# Altium project UPCNSL-ABS-FLS-RFS.PrjPcb
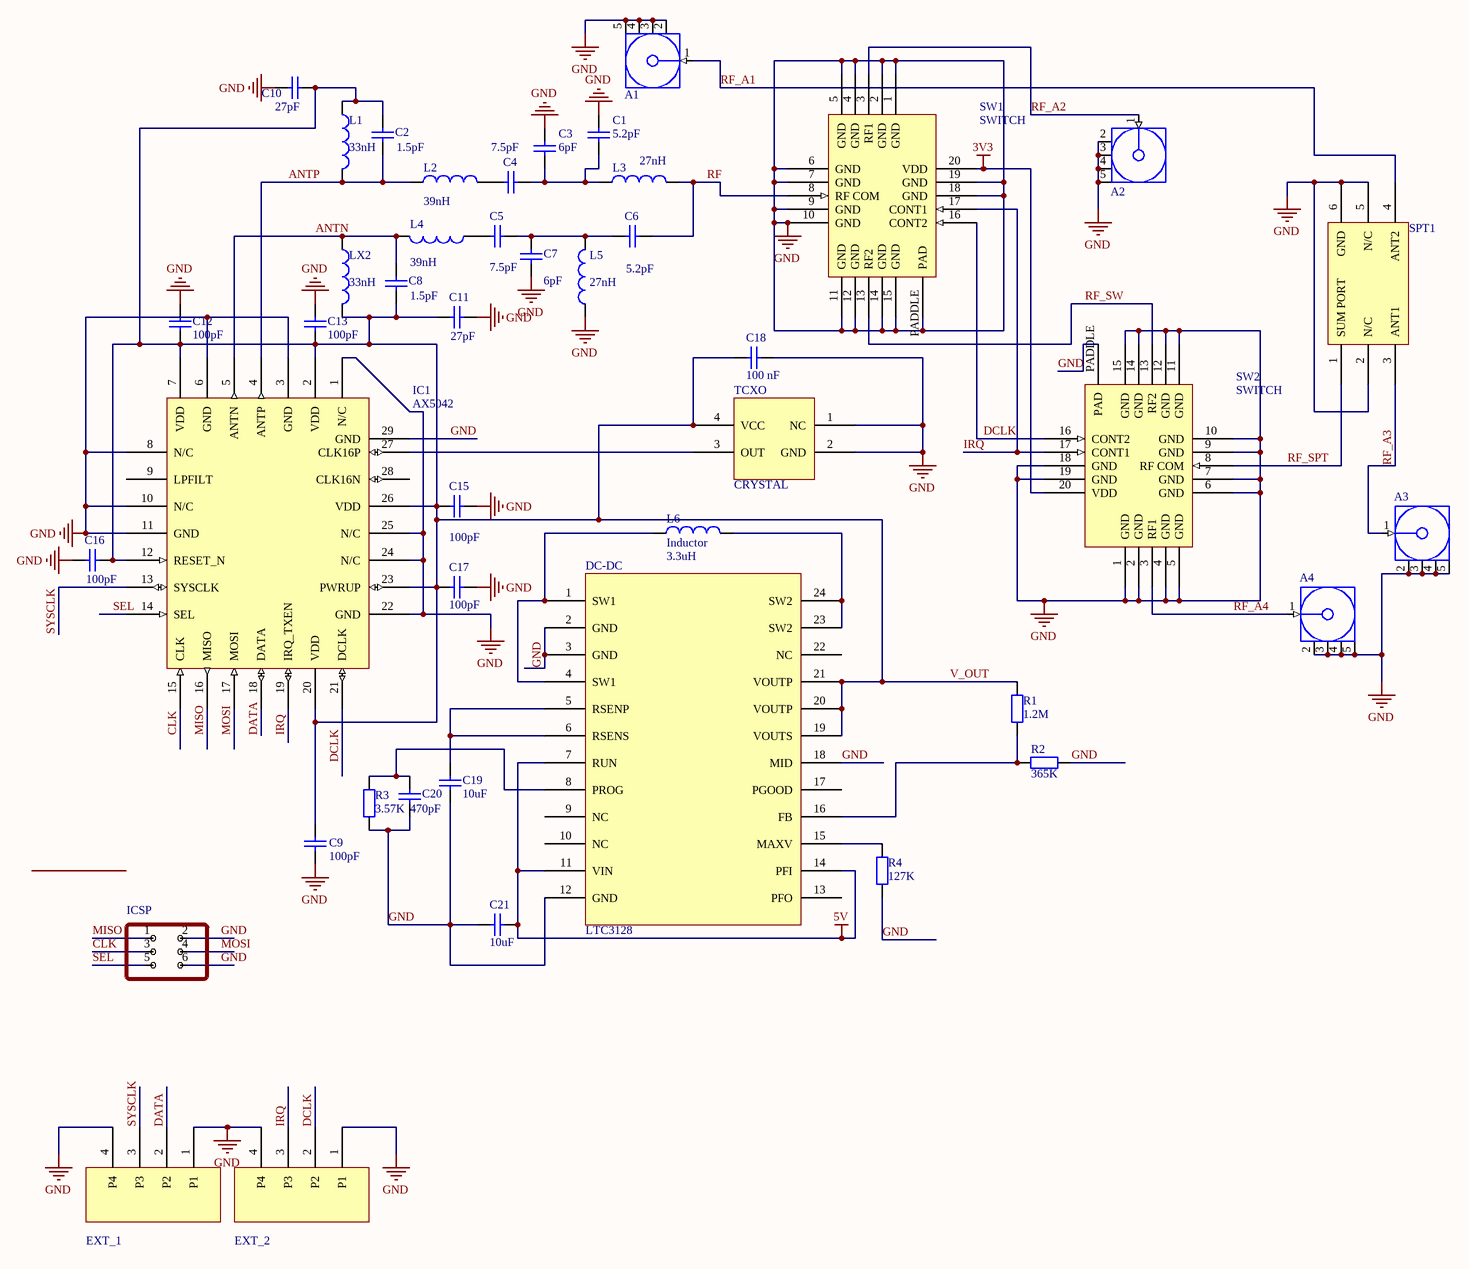
[diagram p0: UPCNSL-ABS-FLS-RFS.SchDoc]
1 sheet, 44 parts. Net scope: global (net labels, ports and power ports of the same name join across sheets).
Board file: UPCNSL-ABS-FLS-RFS.PcbDoc

## Sheet UPCNSL-ABS-FLS-RFS.SchDoc
size A3

### Parts
A1  ANTENNA  [MCX5.08-H5]  (value not drawn)
A2  SORTIDA AMP EXTERN  [MCX5.08-H5]  (value not drawn)
A3  ANTENNA  [MCX5.08-H5]  (value not drawn)
A4  ENTRADA AMP EXTERN  [MCX5.08-H5]  (value not drawn)
C1  value 5.2pF  [CAP0603]  (hidden comment: CB1)
C2  value 1.5pF  [CAP0603]  (hidden comment: CC1)
C3  value 6pF  [CAP0603]  (hidden comment: CM1)
C4  value 7.5pF  [CAP0603]  (hidden comment: CT1)
C5  value 7.5pF  [CAP0603]  (hidden comment: CT2)
C6  value 5.2pF  [CAP0603]  (hidden comment: CB2)
C7  value 6pF  [CAP0603]  (hidden comment: CM2)
C8  value 1.5pF  [CAP0603]  (hidden comment: CC2)
C9  value 100pF  [CAP0603]  (hidden comment: CV1)
C10  value 27pF  [CAP0603]  (hidden comment: Cap)
C11  value 27pF  [CAP0603]  (hidden comment: Cap)
C12  value 100pF  [CAP0603]  (hidden comment: Cap)
C13  value 100pF  [CAP0603]  (hidden comment: Cap)
C15  value 100pF  [CAP0603]  (hidden comment: Cap)
C16  value 100pF  [CAP0603]  (hidden comment: Cap)
C17  value 100pF  [CAP0603]  (hidden comment: Cap)
C18  value 100 nF  [CAP0603]  (hidden comment: Cap)
C19  value 10uF  [CAP0603]  (hidden comment: CAP0603)
C20  value 470pF  [CAP0603]  (hidden comment: CAP0603)
C21  value 10uF  [CAP0603]  (hidden comment: CAP0603)
DC-DC  LTC3128  [DW024 (LTC3128)]
EXT_1  HEADER_CONNECTION  [HEADER_CONNECTION]  (value not drawn)
EXT_2  HEADER_CONNECTION  [HEADER_CONNECTION]  (value not drawn)
IC1  AX5042  [AX5042]
ICSP  3X2M  [Header 3x2]  (value not drawn)
L1  value 33nH  [INDUCTOR(1608)]  (hidden comment: LX1)
L2  value 39nH  [INDUCTOR(1608)]  (hidden comment: LT1)
L3  value 27nH  [INDUCTOR(1608)]  (hidden comment: LB2)
L4  value 39nH  [INDUCTOR(1608)]  (hidden comment: LT2)
L5  value 27nH  [INDUCTOR(1608)]  (hidden comment: LB1)
L6  Inductor  value 3.3uH  [INDUCTOR(1608)]
LX2  value 33nH  [INDUCTOR(1608)]  (hidden comment: LX2)
R1  value 1.2M  [RES0603]  (hidden comment: RES0603)
R2  value 365K  [RES0603]  (hidden comment: RES0603)
R3  value 3.57K  [RES0603]  (hidden comment: RES0603)
R4  value 127K  [RES0603]  (hidden comment: RES0603)
SPT1  2 Way -0º split  [SOTFL254P691X411-6N(splitter 2 way-0)]  (value not drawn)
SW1  SWITCH  [SWITCH]
SW2  SWITCH  [SWITCH]
TCXO  CRYSTAL  [CRYSTAL TG-5006CJ-24L]

### Nets
3V3: SW1.20(VDD) SW2.20(VDD)
5V: C21.1 DC-DC.7(RUN) DC-DC.11(VIN) DC-DC.14(PFI)
GND: A1.2(GND) A1.3(GND) A1.4(GND) A1.5(GND) A2.2(GND) A2.3(GND) A2.4(GND) A2.5(GND) A3.2(GND) A3.3(GND) A3.4(GND) A3.5(GND) A4.2(GND) A4.3(GND) A4.4(GND) A4.5(GND) C1.2 C3.2 C7.2 C9.1 C10.1 C11.2 C12.2 C13.2 C15.2 C16.1 C17.1 C18.1 C19.1 C20.1 C21.2 DC-DC.2(GND) DC-DC.3(GND) DC-DC.12(GND) DC-DC.18(MID) EXT_1.1(P1) EXT_1.4(P4) EXT_2.1(P1) EXT_2.4(P4) IC1.1(N/C) IC1.3(GND) IC1.6(GND) IC1.8(N/C) IC1.10(N/C) IC1.11(GND) IC1.22(GND) IC1.24(N/C) IC1.25(N/C) IC1.29(GND) ICSP.2 ICSP.6 L5.1 R2.1 R3.1 R4.1 SPT1.2(N/C) SPT1.5(N/C) SPT1.6(GND) SW1.1(GND) SW1.2(GND) SW1.4(GND) SW1.5(GND) SW1.6(GND) SW1.7(GND) SW1.9(GND) SW1.10(GND) SW1.11(GND) SW1.12(GND) SW1.14(GND) SW1.15(GND) SW1.18(GND) SW1.19(GND) SW1.PADDLE(PAD) SW2.1(GND) SW2.2(GND) SW2.4(GND) SW2.5(GND) SW2.6(GND) SW2.7(GND) SW2.9(GND) SW2.10(GND) SW2.11(GND) SW2.12(GND) SW2.14(GND) SW2.15(GND) SW2.18(GND) SW2.19(GND) SW2.PADDLE(PAD) TCXO.1(NC) TCXO.2(GND)
ANTN: C8.2 IC1.5(ANTN) L4.2 LX2.1
ANTP: C2.1 IC1.4(ANTP) L1.2 L2.1
CLK: IC1.15(CLK) ICSP.3
DATA: EXT_1.2(P2) IC1.18(DATA)
DCLK: EXT_2.2(P2) IC1.21(DCLK) SW1.16(CONT2) SW2.16(CONT2)
IRQ: EXT_2.3(P3) IC1.19(IRQ_TXEN) SW1.17(CONT1) SW2.17(CONT1)
MISO: IC1.16(MISO) ICSP.1
MOSI: IC1.17(MOSI) ICSP.4
RF: C6.1 L3.2 SW1.8(RF_COM)
RF_A1: A1.1(Signal) SPT1.4(ANT2)
RF_A2: A2.1(Signal) SW1.3(RF1)
RF_A3: A3.1(Signal) SPT1.3(ANT1)
RF_A4: A4.1(Signal) SW2.3(RF1)
RF_SPT: SPT1.1(SUM_PORT) SW2.8(RF_COM)
RF_SW: SW1.13(RF2) SW2.13(RF2)
SEL: IC1.14(SEL) ICSP.5
SYSCLK: EXT_1.3(P3) IC1.13(SYSCLK)
V_OUT: C2.2 C8.1 C9.2 C10.2 C11.1 C12.1 C13.1 C15.1 C16.2 C17.2 C18.2 DC-DC.19(VOUTS) DC-DC.20(VOUTP) DC-DC.21(VOUTP) IC1.2(VDD) IC1.7(VDD) IC1.12(RESET_N) IC1.20(VDD) IC1.23(PWRUP) IC1.26(VDD) L1.1 LX2.2 R1.2 TCXO.4(VCC)
NetC1_1: C1.1 C3.1 C4.1 L3.1
NetC4_2: C4.2 L2.2
NetC5_1: C5.1 C6.2 C7.1 L5.2
NetC5_2: C5.2 L4.1
NetC19_2: C19.2 DC-DC.5(RSENP) DC-DC.6(RSENS)
NetC20_2: C20.2 DC-DC.8(PROG) R3.2
NetDC-DC_1: DC-DC.1(SW1) DC-DC.4(SW1) L6.1
NetDC-DC_15: DC-DC.15(MAXV) R4.2
NetDC-DC_16: DC-DC.16(FB) R1.1 R2.2
NetDC-DC_23: DC-DC.23(SW2) DC-DC.24(SW2) L6.2
NetIC1_27: IC1.27(CLK16P) TCXO.3(OUT)

Not connected (* = marked no-connect by the designer): DC-DC 9(NC) 10(NC) 13(PFO) 17(PGOOD) 22(NC); IC1 9(LPFILT) 28(CLK16N)

### Library data of the parts
A1-A4 = COAX-F: RF Coaxial PCB Connector, MCX; Thru-Hole, Right-Angle Mount Socket, Blunt Post Terminal, 50 Ohm Impedance; PCB_Layout: Complies with manufacturer's recommendation.; DrillSize: Corresponds to nominal value.; Published: 15-Jul-2004; LatestRevisionDate: 15-Jul-2004; LatestRevisionNote: Component Replaced.; DatasheetDocument: 30-May-2003; PackageDocument: 04-Jul-1999; PackageReference: 919-119J-51AX; Publisher: Altium Limited; ComponentLink1Description: Manufacturer Link; ComponentLink1URL: http://www.amphenolrf.com/
C1-C13 C15-C18 = Cap: Capacitor; Published: 8-Jun-2000; LatestRevisionDate: 17-Jul-2002; LatestRevisionNote: Re-released for DXP Platform.; PackageReference: RAD-0.3; Publisher: Altium Limited; PackageDescription: Radial Cap, Thru-Hole; 2 Leads; 0.3 in Pin Spacing
C19-C21 = CAP0603: Capacitor
ICSP = HEADER 3X2: PIN HEADER
L1-L6 LX2 = Inductor: Code_IEC: 1005; Published: 8-Jun-2000; LatestRevisionDate: 29-May-2009; LatestRevisionNote: IPC-7351 Footprint Added.; PackageReference: 0402-A; Publisher: Altium Limited; PackageDescription: Chip Inductor; Code_JEITA: 0402
R1-R4 = RES0603: Resistor
SPT1 = 2 WAY-0º: Splitter with 0º phase